# EAGLE design Breakout (EAGLE 9.1.1)
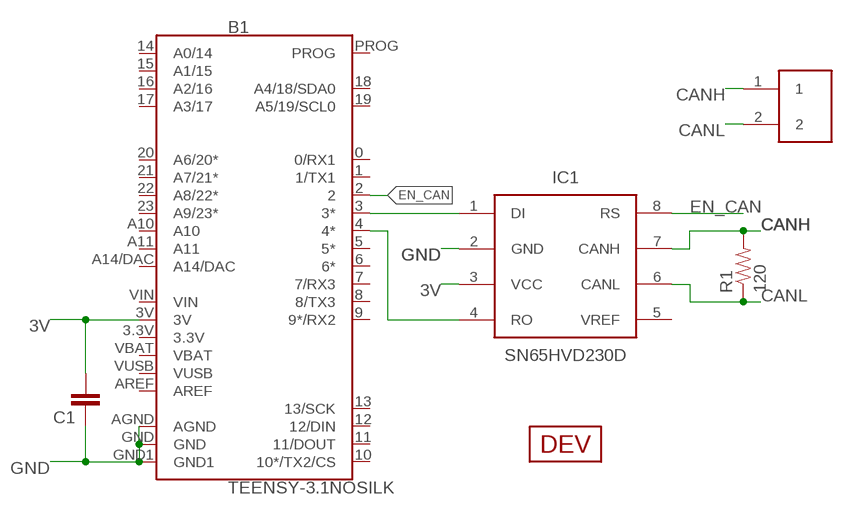
[diagram p0: schematic, sheet 1]

## Parts
B1  TEENSY-3.1NOSILK  [TEENSY-3.1_NOSILK]
C1  CAP0603-CAP  [0603-CAP]
IC1  SN65HVD230D  [SO-8]
R1  120  RESISTOR0603-RES  [0603-RES]
U$1  HEADER2  [2PINVALULOK]
U$2  DEV  [DEV]

## Nets
3V: B1.3V C1.2 IC1.3(VCC)
CANH: IC1.7(CANH) R1.2 U$1.1
CANL: IC1.6(CANL) R1.1 U$1.2
EN_CAN: B1.2 IC1.8(RS)
GND: B1.AGND B1.GND B1.GND1 C1.1 IC1.2(GND)
N$1: B1.3(3*) IC1.1(DI)
N$2: B1.4(4*) IC1.4(RO)
Unconnected: B1.0(0/RX1) B1.1(1/TX1) B1.5(5*) B1.6(6*) B1.7(7/RX3) B1.8(8/TX3) B1.9(9*/RX2) B1.10(10*/TX2/CS) B1.11(11/DOUT) B1.12(12/DIN) B1.13(13/SCK) B1.14(A0/14) B1.15(A1/15) B1.16(A2/16) B1.17(A3/17) B1.18(A4/18/SDA0) B1.19(A5/19/SCL0) B1.20(A6/20*) B1.21(A7/21*) B1.22(A8/22*) B1.23(A9/23*) B1.A10 B1.A11 B1.A14/DAC B1.AREF B1.PROG IC1.5(VREF)

## Power pins joined to a net without a drawn wire
3V: B1.3.3V
VBAT: B1.VBAT
VIN: B1.VIN
VUSB: B1.VUSB

## Library data of the parts
B1 = SparkFun-Boards:TEENSY-3.1: Teensy 3+ Footprint Mechanical footprint with connectors for Teensy Development Board with ARM Cortex. SparkFun Products: Teensy 3.2 <https://www.sparkfun.com/products/13736> Teensy LC <https://www.sparkfun.com/products/13305>; SF_ID: DEV-12646
C1 = SparkFun-Capacitors:CAP: Capacitor Standard 0603 ceramic capacitor, and 0.1" leaded capacitor.
IC1 = Misaka-IC:SN65HVD23*D: 3.3V CAN Bus Transceiver Supply voltage: 3...3.6V Max rate: 1Mbps Standby mode(SN65HVD230D) Sleep mode(SN65HVD231D) Slope control mode
R1 = SparkFun-Passives:RESISTOR: Resistor Basic schematic elements and footprints for 0603, 1206, and PTH resistors.
U$1 = Custom_old:HEADER2
U$2 = Custom_old:DEV

## Net classes
0 default: width 0.203 mm

## Board
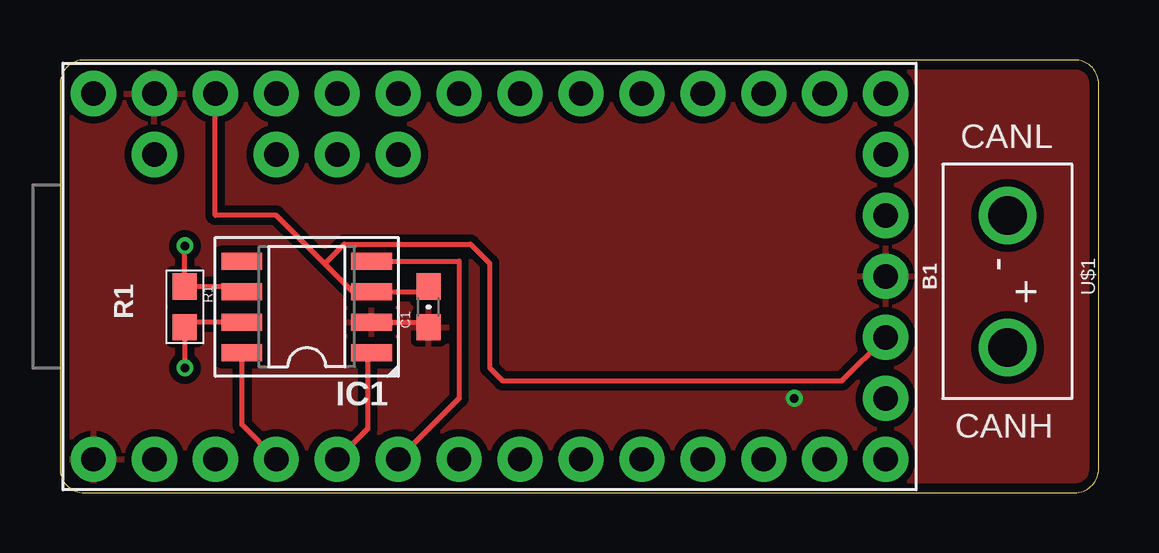
[diagram p1: board, top side]
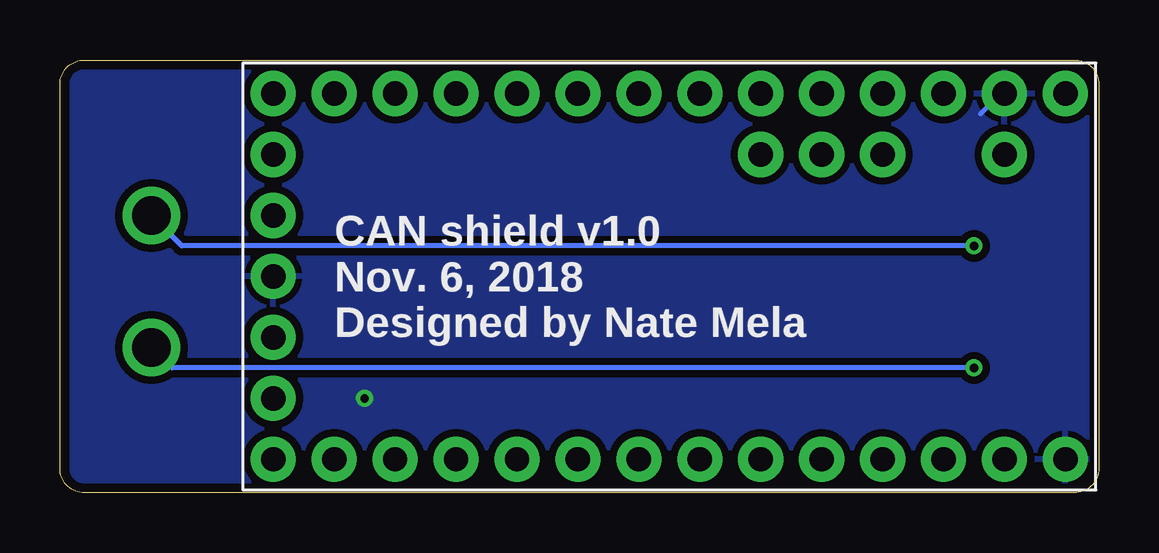
[diagram p2: board, bottom side, seen from below]

Size 43.31 x 18.03 mm. Coordinates in mm from the lower left corner, seen from the top.
Outline: 0,17.02 0,1.02 arc90 1.02,0 42.29,0 arc90 43.31,1.02 43.31,17.02 arc90 42.29,18.03 1.02,18.03 arc90 0,17.02
Copper layers (1*16): Top 0.0356mm / dielectric 1.5011mm / Bottom 0.0356mm
Design rules "jlcpcb_tented": minimum track width 5mil, minimum drill 13mil, track to track 5mil, track to pad 5mil, pad to pad 5mil, via to via 5mil, smd to smd 5mil, copper to edge 15mil, drill to drill 6mil, minimum pad ring 7mil, minimum via ring 7mil, stop-mask expansion 2.5mil, vias tented up to drill 0.35mm, thermal gap 10mil

### Footprints (pad centres in the part's own frame; a part is rotated, then mirrored left to right if it is on the bottom)
TEENSY-3.1_NOSILK = drill 1.016 pad 1.88: 0 7.62,-13.97; 1 7.62,-11.43; 2 7.62,-8.89; 3 7.62,-6.35; 3.3V 2.54,16.51; 3V -7.62,-11.43; 4 7.62,-3.81; 5 7.62,-1.27; 6 7.62,1.27; 7 7.62,3.81; 8 7.62,6.35; 9 7.62,8.89; 10 7.62,11.43; 11 7.62,13.97; 12 7.62,16.51; 13 -7.62,16.51; 14 -7.62,13.97; 15 -7.62,11.43; 16 -7.62,8.89; 17 -7.62,6.35; 18 -7.62,3.81; 19 -7.62,1.27; 20 -7.62,-1.27; 21 -7.62,-3.81; 22 -7.62,-6.35; 23 -7.62,-8.89; A10 -5.08,-6.35; A11 -5.08,-3.81; A14/DAC -5.08,16.51; AGND -7.62,-13.97; AREF -5.08,-8.89; GND 0,16.51; GND1 7.62,-16.51; PROG -2.54,16.51; VBAT 5.08,16.51; VIN -7.62,-16.51; VUSB -5.08,-13.97
0603-CAP = smd 1.1 x 1: 1 -0.85,0; 2 0.85,0
SO-8 = smd 1.7 x 0.7: 1 -2.7,1.905; 2 -2.7,0.635; 3 -2.7,-0.635; 4 -2.7,-1.905; 5 2.7,-1.905; 6 2.7,-0.635; 7 2.7,0.635; 8 2.7,1.905
0603-RES = smd 1.1 x 1: 1 -0.85,0; 2 0.85,0
2PINVALULOK = drill 1.6: 1 0,5.5; 2 0,0

### Placement (x,y rotation side)
B1  17.91,9.02 270 top
C1  15.37,7.75 90 top
IC1  10.29,7.75 180 top
R1  5.21,7.75 270 top
U$1  39.5,11.56 180 top
U$2  19.18,6.48 0 top

### Tracks (layer width: path | path; a pad name or v marks a point on that pad's centre or on a via)
3V
  Top 0.203: C1.2 15.15,8.38 IC1.3 12.19,8.38 11.03,9.54 | B1.3V 6.48,11.56 9.02,11.56 11.03,9.54 | 11.03,9.54 11.02,9.54 11.03,9.54 | 11.03,9.54 11.85,10.36 17.11,10.36 17.91,9.56 17.91,5.21 18.45,4.66 32.6,4.66 B1.3.3V
CANH  (via drill 0.35)
  Top 0.203: IC1.7 5.42,7.11 | R1.2 v5.21,5.21
  Top 0.508: 5.42,7.11 R1.2
  Bottom 0.203: v5.21,5.21 38.65,5.21 U$1.1
CANL  (via drill 0.35)
  Top 0.203: IC1.6 7.37,8.6 R1.1 v5.21,10.29
  Bottom 0.203: v5.21,10.29 38.23,10.29 U$1.2
EN_CAN
  Top 0.203: B1.2 7.59,2.83 IC1.8
GND  (via drill 0.35)
  Top 0.203: IC1.2 15.15,7.11 C1.1
  Bottom 0.203: B1.AGND 4.09,16.64 4.92,15.81 4.92,15.79
  other vias: 30.61,3.94
  pour Top (isolate 0.305): -3.05,19.18 43.94,19.18 43.94,-1.78 -3.05,-1.78
  pour Bottom (isolate 0.305): -3.05,19.18 43.94,19.18 43.94,-1.78 -3.05,-1.78
N$1
  Top 0.203: IC1.1 12.83,5.68 12.83,2.67 B1.3
N$2
  Top 0.203: IC1.4 16.64,9.65 16.64,3.94 B1.4

### Text on the board
tPlace: CANL | CANH
bPlace: CAN shield v1.0 / Nov. 6, 2018 / Designed by Nate Mela